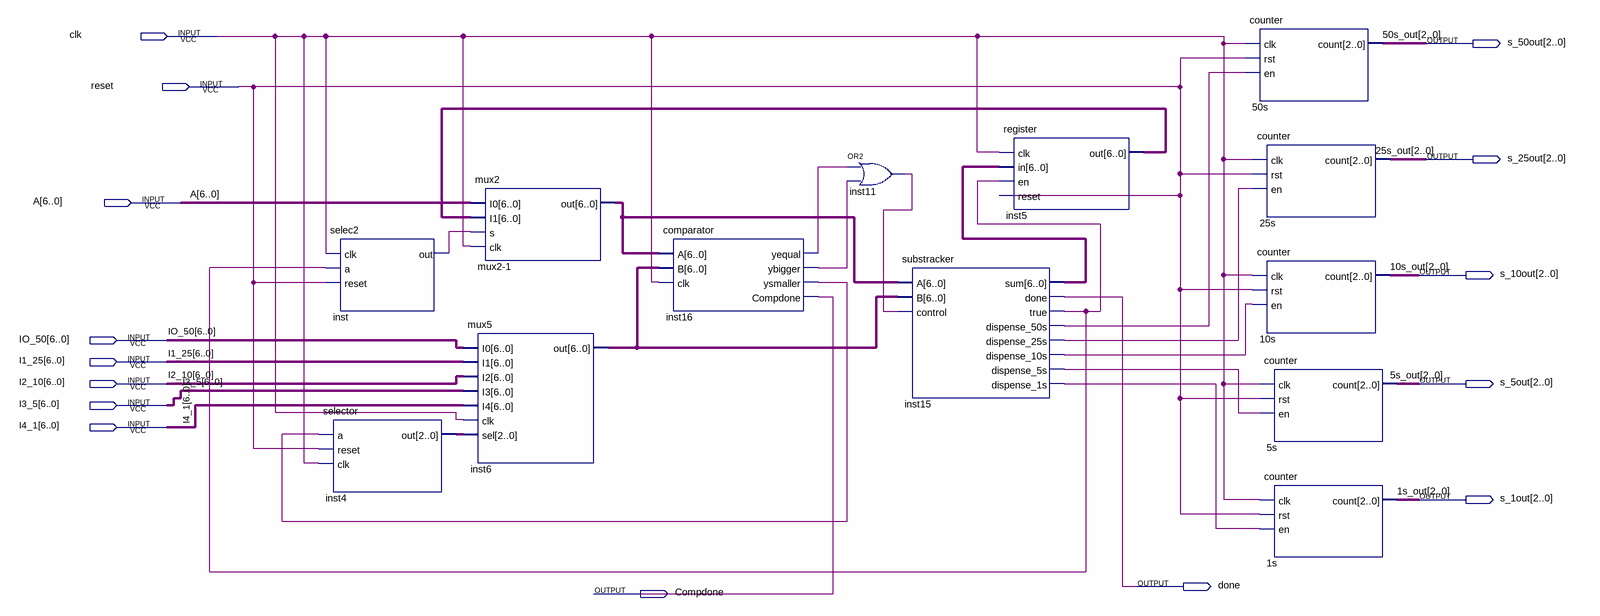
[diagram p0: schematic sheet]
// Quartus schematic comparatorwork.bdf as structural Verilog: 13 symbols, 15 pins
module comparatorwork (
  input  clk,
  input  reset,
  input  [6:0] A,
  input  [6:0] IO_50,
  input  [6:0] I1_25,
  input  [6:0] I2_10,
  input  [6:0] I3_5,
  input  [6:0] I4_1,
  output [2:0] s_50out,
  output [2:0] s_25out,
  output [2:0] s_10out,
  output [2:0] s_5out,
  output [2:0] s_1out,
  output done,
  output Compdone
);

  wire inst11_out, inst15_dispense_1s, inst15_dispense_5s, inst15_dispense_10s, inst15_dispense_25s,
       inst15_dispense_50s, inst15_true, inst16_ybigger, inst16_yequal, inst16_ysmaller, inst_out;
  wire [2:0] inst4_out;
  wire [6:0] inst5_out, inst6_out, inst15_sum, mux2_1_out;

  selec2 inst (.clk(clk), .a(inst15_true), .reset(reset), .out(inst_out));
  selector inst4 (.a(inst16_ysmaller), .reset(reset), .clk(clk), .out(inst4_out));
  mux2 \mux2-1  (.I0(A), .I1(inst5_out), .s(inst_out), .clk(clk), .out(mux2_1_out));
  mux5 inst6 (.I0(IO_50), .I1(I1_25), .I2(I2_10), .I3(I3_5), .I4(I4_1), .clk(clk), .sel(inst4_out), .out(inst6_out));
  comparator inst16 (
    .A(mux2_1_out), .B(inst6_out), .clk(clk), .yequal(inst16_yequal), .ybigger(inst16_ybigger),
    .ysmaller(inst16_ysmaller), .Compdone(Compdone));
  or inst11 (inst11_out, inst16_yequal, inst16_ybigger);
  substracker inst15 (
    .A(mux2_1_out), .B(inst6_out), .control(inst11_out), .sum(inst15_sum), .done(done), .true(inst15_true),
    .dispense_50s(inst15_dispense_50s), .dispense_25s(inst15_dispense_25s),
    .dispense_10s(inst15_dispense_10s), .dispense_5s(inst15_dispense_5s), .dispense_1s(inst15_dispense_1s));
  register inst5 (.clk(clk), .in(inst15_sum), .en(inst15_true), .reset(reset), .out(inst5_out));
  counter u_50s (.clk(clk), .rst(reset), .en(inst15_dispense_50s), .count(s_50out));
  counter u_25s (.clk(clk), .rst(reset), .en(inst15_dispense_25s), .count(s_25out));
  counter u_10s (.clk(clk), .rst(reset), .en(inst15_dispense_10s), .count(s_10out));
  counter u_5s (.clk(clk), .rst(reset), .en(inst15_dispense_5s), .count(s_5out));
  counter u_1s (.clk(clk), .rst(reset), .en(inst15_dispense_1s), .count(s_1out));

  // Other names for the same wires on the sheet: 1s_out[2:0] = s_1out; 5s_out[2:0] = s_5out; 10s_out[2:0] = s_10out;
  //   25s_out[2:0] = s_25out; 50s_out[2:0] = s_50out
endmodule
